# Altium schematic sheet 05004586宁波2号线二期车载PIS系统_功率放大器音频板2 BHC-A-2030-05_原理图 V1.0.SchDoc
size 594 x 419 mm; SheetNumber: 0; SheetTotal: 0; PageSetup: Record=PageOptions|CenterHorizontal=True|CenterVertical=True|PrintScale=0.68|XCorrection=1.00|YCorrection=1.00|PrintKind=0|BorderSize=5000000|LeftOffset=0|BottomOffset=0|Orientation=2|PaperLength=4200|PaperWidth=2970|Scale=100|PaperSource=7|PrintQuality=600|MediaType=1|DitherType=10|PaperKind=A3|PrintScaleMode=1
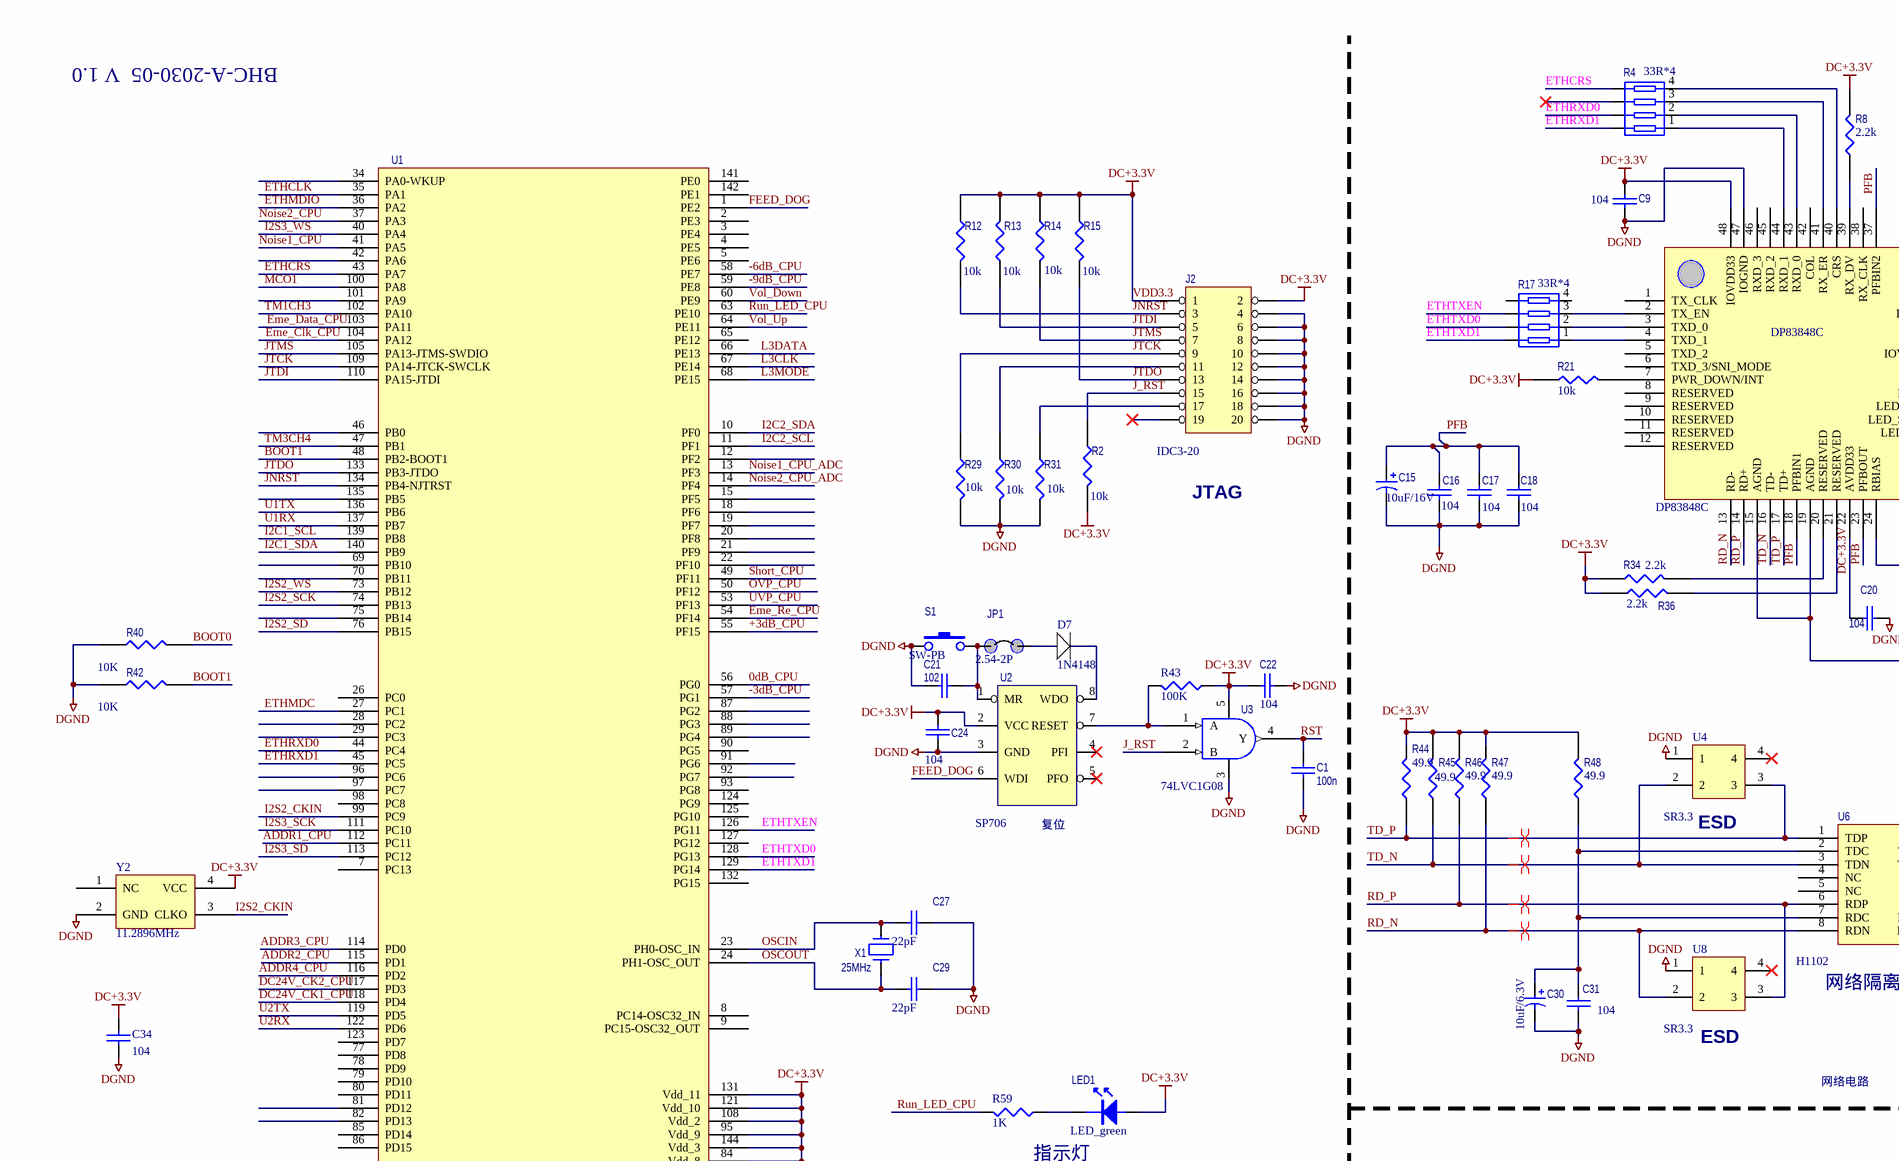
[diagram p0: 05004586宁波2号线二期车载PIS系统_功率放大器音频板2 BHC-A-2030-05_原理图 V1.0.SchDoc, top left]
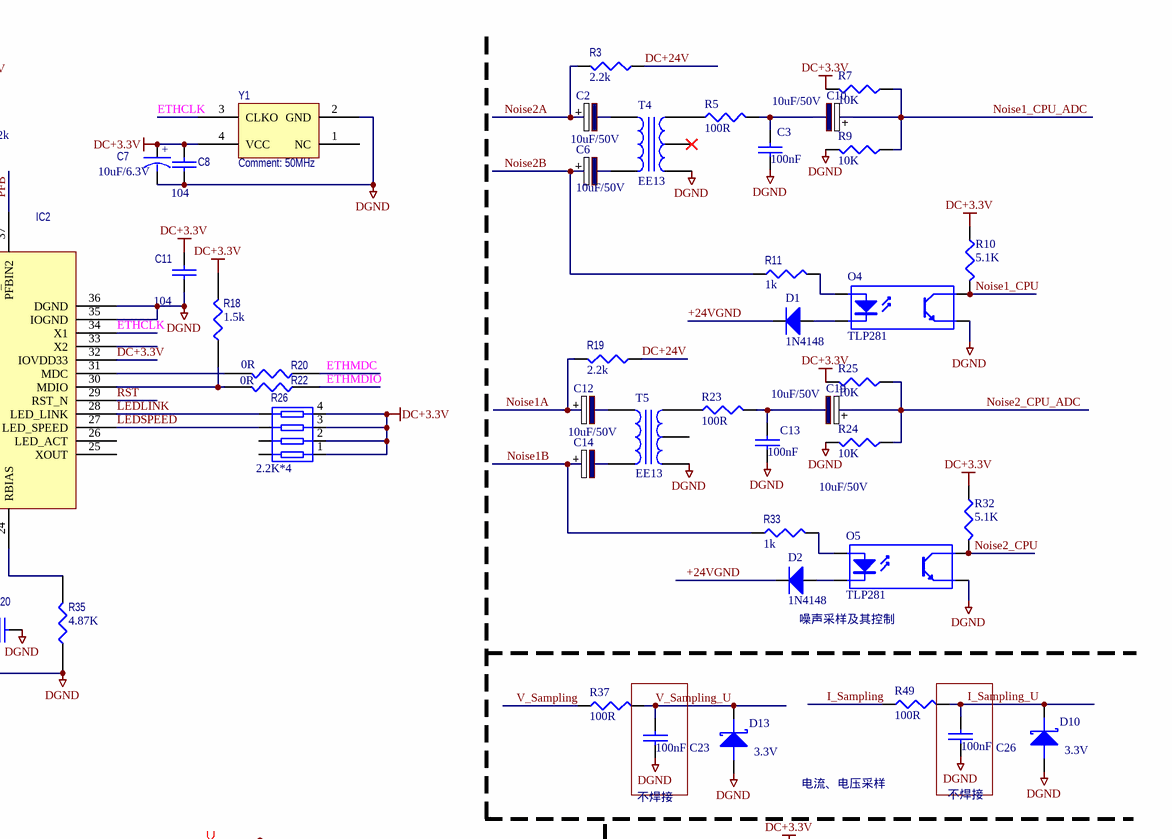
[diagram p1: 05004586宁波2号线二期车载PIS系统_功率放大器音频板2 BHC-A-2030-05_原理图 V1.0.SchDoc, top right]
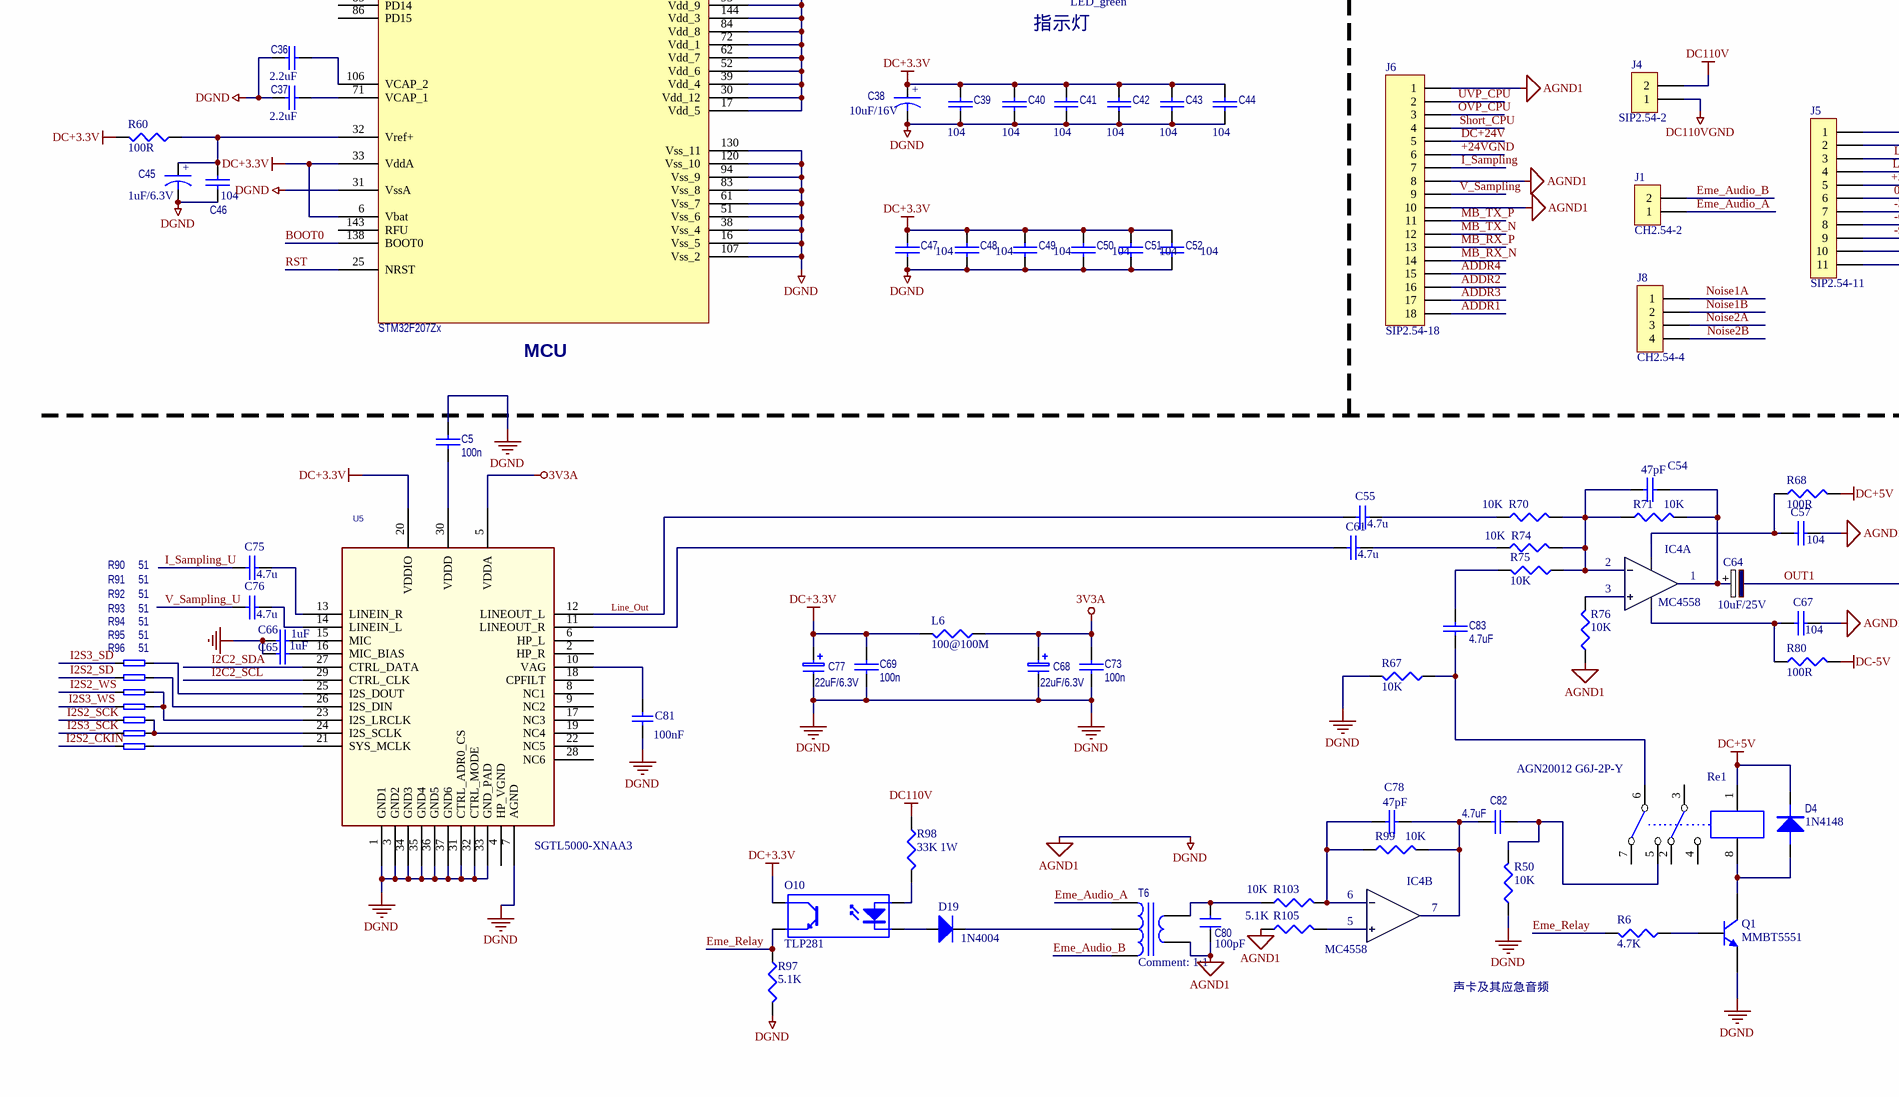
[diagram p2: 05004586宁波2号线二期车载PIS系统_功率放大器音频板2 BHC-A-2030-05_原理图 V1.0.SchDoc, bottom left]
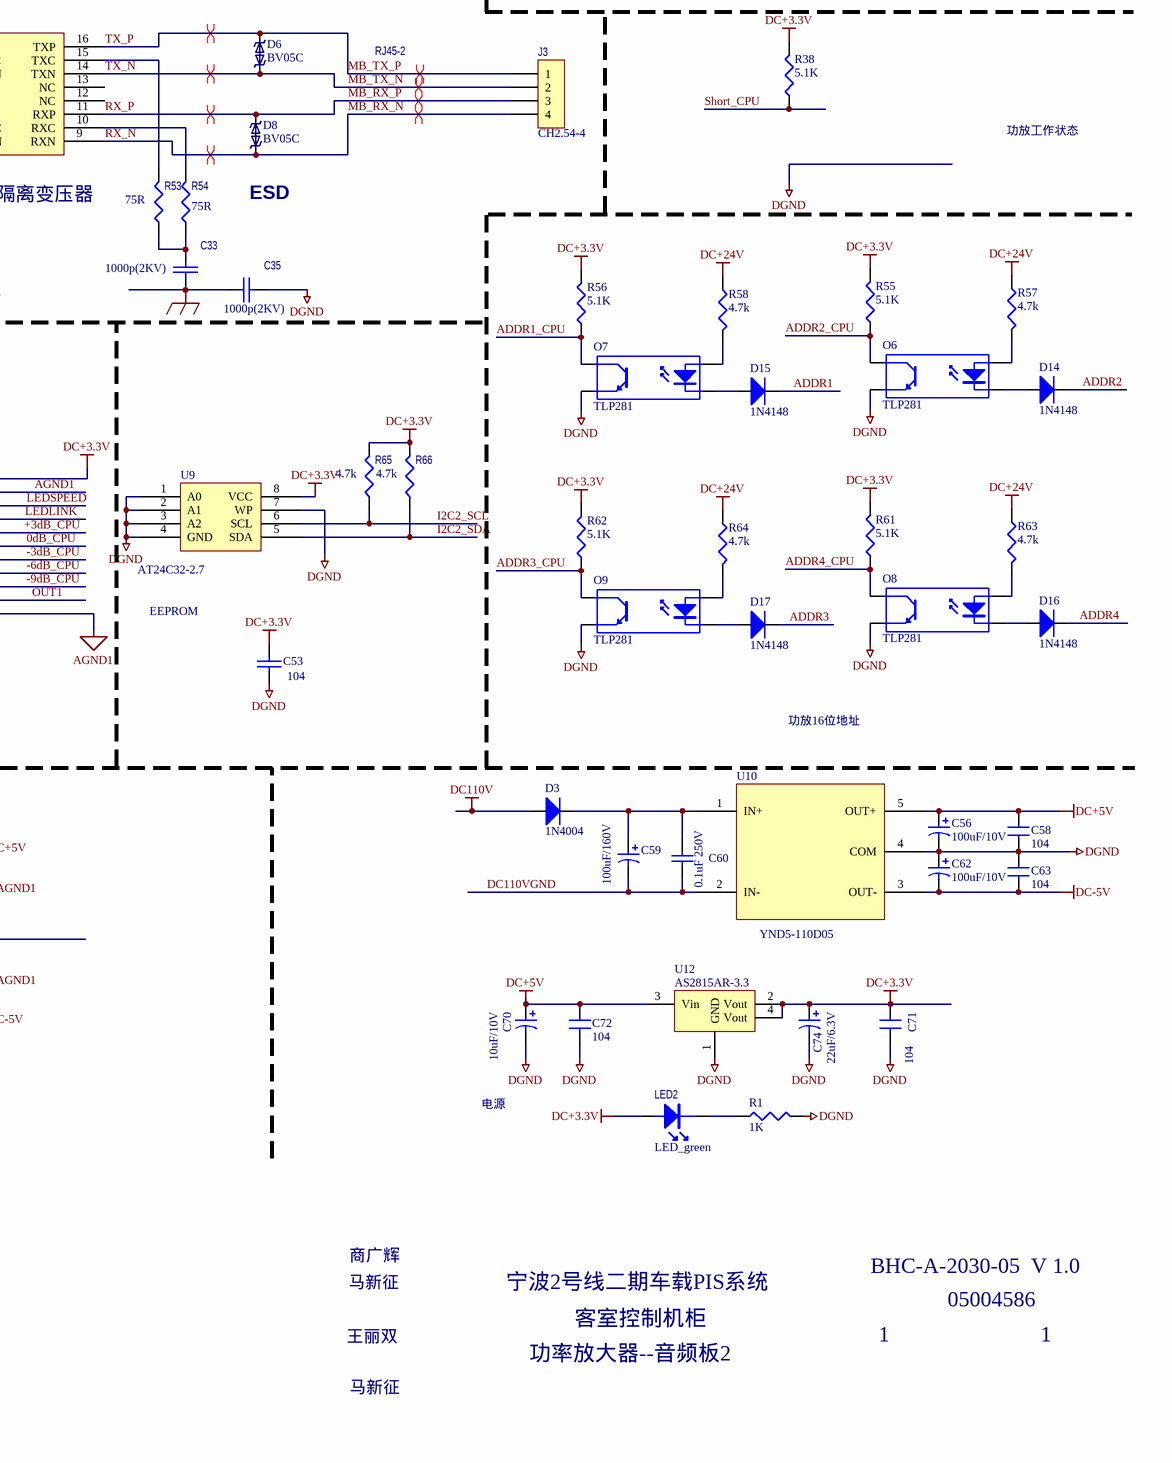
[diagram p3: 05004586宁波2号线二期车载PIS系统_功率放大器音频板2 BHC-A-2030-05_原理图 V1.0.SchDoc, bottom right]

## Parts
C1  100n  [C0805]
C2  value 10uF/50V  [RB1/2]  (hidden comment: 10uF/25V)
C3  value 100nF  [C0805]
C5  100n  [C0805]
C6  value 10uF/50V  [RB1/2]  (hidden comment: 10uF/25V)
C7  value 10uF/6.3V  [3216A]
C8  104  [C0805]
C9  104  [C0805]
C10  value 10uF/50V  [RB1/2]  (hidden comment: 10uF/25V)
C11  104  [C0805]
C12  value 10uF/50V  [RB1/2]  (hidden comment: 10uF/25V)
C13  value 100nF  [C0805]
C14  value 10uF/50V  [RB1/2]  (hidden comment: 10uF/25V)
C15  10uF/16V  [CAP-B]
C16  104  [C0805]
C17  104  [C0805]
C18  104  [C0805]
C19  value 10uF/50V  [RB1/2]  (hidden comment: 10uF/25V)
C20  104  [C0805]
C21  102  [C0805]
C22  104  [C0805]
C23  value 100nF  [C0805]
C24  104  [C0805]
C26  value 100nF  [C0805]
C27  value 22pF  [C0805]
C29  22pF  [C0805]
C30  value 10uF/6.3V  [3216A]  (hidden comment: 10uF/10V)
C31  104  [C0805]
C33  1000p(2KV)  [C1206]
C34  104  [C0805]
C35  1000p(2KV)  [C1206]
C36  2.2uF  [C0805]
C37  2.2uF  [C0805]
C38  value 10uF/16V  [CAP-B]
C39  104  [C0805]
C40  104  [C0805]
C41  104  [C0805]
C42  104  [C0805]
C43  104  [C0805]
C44  104  [C0805]
C45  value 1uF/6.3V  [3216A]
C46  104  [C0805]
C47  104  [C0805]
C48  104  [C0805]
C49  104  [C0805]
C50  104  [C0805]
C51  104  [C0805]
C52  104  [C0805]
C53  104  [C0805]
C54  47pF  [C0805]
C55  value 4.7u  [C0805]  (hidden comment: 104)
C56  value 100uF/10V  [CAP-D]  (hidden comment: 100uF/16V)
C57  104  [C0805]
C58  104  [C0805]
C59  value 100uF/160V  [E100]  (hidden comment: 100uF/16V)
C60  value 0.1uF 250V  [M1206]
C61  value 4.7u  [C0805]  (hidden comment: 104)
C62  value 100uF/10V  [CAP-D]  (hidden comment: 100uF/16V)
C63  104  [C0805]
C64  10uF/25V  [RB1/2]
C65  1uF  [C0805]
C66  1uF  [C0805]
C67  104  [C0805]
C68  22uF/6.3V  [3216A]
C69  100n  [C0805]
C70  10uF/10V  [3216A]
C71  104  [C0805]
C72  104  [C0805]
C73  100n  [C0805]
C74  22uF/6.3V  [3216A]
C75  value 4.7u  [C0805]  (hidden comment: 104)
C76  value 4.7u  [C0805]  (hidden comment: 104)
C77  22uF/6.3V  [3216A]
C78  47pF  [C0805]
C80  value 100pF  [C0805]  (hidden comment: 100p)
C81  value 100nF  [C0805]  (hidden comment: 100n)
C82  4.7uF  [C0805]
C83  4.7uF  [C0805]
D1  value 1N4148  [7227AK]  (hidden comment: DIODE)
D2  value 1N4148  [7227AK]  (hidden comment: DIODE)
D3  value 1N4004  [7227AK]  (hidden comment: DIODE)
D4  value 1N4148  [7227AK]  (hidden comment: 1N4004)
D6  BV05C  [SOD-323]
D7  value 1N4148  [1206AK]
D8  BV05C  [SOD-323]
D10  value 3.3V  [1206ak]
D13  value 3.3V  [1206ak]
D14  value 1N4148  [7227AK]  (hidden comment: DIODE)
D15  value 1N4148  [7227AK]  (hidden comment: DIODE)
D16  value 1N4148  [7227AK]  (hidden comment: DIODE)
D17  value 1N4148  [7227AK]  (hidden comment: DIODE)
D19  value 1N4004  [7227AK]  (hidden comment: DIODE)
IC2  DP83848C  [LQFP48]
IC4  MC4558  [SO-8]  (parts A,B of 2)
J1  value CH2.54-2  [CH2.54-2]  (hidden comment: CON2)
J2  value IDC3-20  [IDC3-20]  (hidden comment: IDC20)
J3  value CH2.54-4  [CH2.54-4]  (hidden comment: CON4)
J4  value SIP2.54-2  [SIP2.54-2]  (hidden comment: CON2)
J5  value SIP2.54-11  [SIP2.54-11]  (hidden comment: CON11)
J6  value SIP2.54-18  [SIP2.54-18]  (hidden comment: CON18)
J8  value CH2.54-4  [CH2.54-4]  (hidden comment: CON4)
JP1  2.54-2P  [SIP2.54-2]
L6  value 100@100M  [M0805]  (hidden comment: 10uH)
LED1  value LED_green  [LED(贴片)]
LED2  value LED_green  [LED(贴片)]
O4  TLP281  [SOP4]
O5  TLP281  [SOP4]
O6  TLP281  [SOP4]
O7  TLP281  [SOP4]
O8  TLP281  [SOP4]
O9  TLP281  [SOP4]
O10  TLP281  [SOP4]
Q1  MMBT5551  [SOT-23B_N]
R1  value 1K  [M0805]
R2  10K  [M0805]
R3  value 2.2k  [M0805]
R4  value 33R*4  [PZ-4-0.8B]  (hidden comment: 33*4)
R5  value 100R  [M0805]
R6  value 4.7K  [M0805]  (hidden comment: Res3)
R7  value 10K  [M0805]
R8  value 2.2k  [M0805]  (hidden comment: 10K)
R9  value 10K  [M0805]
R10  value 5.1K  [M0805]
R11  value 1k  [M0805]
R12  10K  [M0805]
R13  10K  [M0805]
R14  10K  [M0805]
R15  10K  [M0805]
R17  value 33R*4  [PZ-4-0.8B]  (hidden comment: 33*4)
R18  value 1.5k  [M0805]  (hidden comment: 10K)
R19  value 2.2k  [M0805]
R20  value 0R  [M0805]
R21  10K  [M0805]
R22  value 0R  [M0805]
R23  value 100R  [M0805]
R24  value 10K  [M0805]
R25  value 10K  [M0805]
R26  (no value)  [PZ-4-0.8B]
R29  10K  [M0805]
R30  10K  [M0805]
R31  10K  [M0805]
R32  value 5.1K  [M0805]
R33  value 1k  [M0805]
R34  value 2.2k  [M0805]  (hidden comment: 10K)
R35  value 4.87K  [M0805]
R36  value 2.2k  [M0805]  (hidden comment: 10K)
R37  value 100R  [M0805]
R38  value 5.1K  [M0805]
R40  10K  [M0805]
R42  10K  [M0805]
R43  value 100K  [M0805]
R44  value 49.9  [M0805]
R45  value 49.9  [M0805]
R46  value 49.9  [M0805]
R47  value 49.9  [M0805]
R48  value 49.9  [M0805]
R49  value 100R  [M0805]
R50  10k  [M0805]
R53  value 75R  [M0805]
R54  value 75R  [M0805]
R55  value 5.1K  [M0805]
R56  value 5.1K  [M0805]
R57  value 4.7k  [M1206]
R58  value 4.7k  [M1206]
R59  value 1K  [M0805]
R60  value 100R  [M0805]
R61  value 5.1K  [M0805]
R62  value 5.1K  [M0805]
R63  value 4.7k  [M1206]
R64  value 4.7k  [M1206]
R65  value 4.7k  [M0805]
R66  value 4.7k  [M0805]
R67  10k  [M0805]
R68  100R  [M0805]
R70  value 10K  [M0805]  (hidden comment: 15k)
R71  value 10K  [M0805]  (hidden comment: 11k)
R74  10k  [M0805]
R75  10k  [M0805]
R76  10k  [M0805]
R80  100R  [M0805]
R90  51  [M0805]
R91  51  [M0805]
R92  51  [M0805]
R93  51  [M0805]
R94  51  [M0805]
R95  51  [M0805]
R96  51  [M0805]
R97  value 5.1K  [M0805]
R98  value 33K 1W  [1T-2512]
R99  value 10K  [M0805]  (hidden comment: 11k)
R103  10k  [M0805]
R105  value 5.1K  [M0805]  (hidden comment: 10k)
Re1  AGN20012 G6J-2P-Y  [G6J-2P]
S1  SW-PB  [KEY-6A]
T4  EE13  [EE13-C]
T5  EE13  [EE13-C]
T6  1:1  [EE13-C]
U1  STM32F207Zx  [LQFP144]
U2  value SP706  [so-8]  (hidden comment: MAX706R)
U3  74LVC1G08  [SOT-23-5+]
U4  SR3.3  [SOT-143]
U5  value SGTL5000-XNAA3  [QFN32]  (hidden comment: SGTL5000-XNAA3_0)
U6  H1102  [SOP-16]
U8  SR3.3  [SOT-143]
U9  AT24C32-2.7  [SO-8]
U10  value YND5-110D05  [YND5-48D12]
U12  AS2815AR-3.3  [TO-252-1]
X1  25MHz  [XTAL-D]
Y1  50MHz  [XTAL-XO53]
Y2  11.2896MHz  [XTAL-XO53]

## Nets
3V3A: C68.1 C73.2 L6.1 U5.5(VDDA)
AGND1: C1.1 C3.1 C5.2 C7.2 C8.1 C9.2 C11.1 C13.1 C15.2 C16.1 C17.1 C18.1 C20.1 C21.2 C22.1 C23.1 C24.1 C26.1 C27.2 C29.2 C30.2 C31.1 C34.1 C35.2 C36.1 C37.1 C38.2 C39.1 C40.1 C41.1 C42.1 C43.1 C44.1 C45.2 C46.1 C47.1 C48.1 C49.1 C50.1 C51.1 C52.1 C53.1 C56.2 C57.1 C58.1 C62.1 C63.2 C65.2 C66.2 C67.1 C68.2 C69.1 C70.2 C71.2 C72.2 C73.1 C74.2 C77.2 C80.2 C81.1 D10.A D13.A IC2.15(AGND) IC2.19(AGND) IC2.35(IOGND) IC2.36(DGND) IC2.47(IOGND) J2.4 J2.6 J2.8 J2.10 J2.12 J2.14 J2.16 J2.18 J2.20 J5.2 J5.11 J6.1 J6.8 J6.10 O4.3(E) O5.3(E) O6.3(E) O7.3(E) O8.3(E) O9.3(E) Q1.2(E) R1.1 R9.2 R24.2 R29.1 R30.1 R31.1 R35.2 R40.2 R42.2 R50.1 R67.2 R76.1 R97.1 R105.1 S1.1 T4.5 T5.5 T6.1 U1.16(Vss_5) U1.31(VssA) U1.38(Vss_4) U1.51(Vss_6) U1.61(Vss_7) U1.83(Vss_8) U1.94(Vss_9) U1.107(Vss_2) U1.120(Vss_10) U1.130(Vss_11) U2.3(GND) U3.3(G) U4.1 U5.1(GND1) U5.3(GND2) U5.7(AGND) U5.31(CTRL_ADR0_CS) U5.32(CTRL_MODE) U5.33(GND_PAD) U5.34(GND3) U5.35(GND4) U5.36(GND5) U5.37(GND6) U8.1 U9.1(A0) U9.2(A1) U9.3(A2) U9.4(GND) U9.7(WP) U10.4(COM) U12.1(GND) Y1.2(GND) Y2.2(GND)  [also labelled DGND, G]
DC110V: D3.A J4.2 R98.2
DC110VGND: C59.2 C60.1 J4.1 U10.2(IN-)
DC+3.3V: C7.1 C8.2 C9.1 C11.2 C20.2 C22.2 C24.2 C34.2 C38.1 C39.2 C40.2 C41.2 C42.2 C43.2 C44.2 C47.2 C48.2 C49.2 C50.2 C51.2 C52.2 C53.2 C69.2 C71.1 C74.1 C77.1 IC2.22(AVDD33) IC2.32(IOVDD33) IC2.48(IOVDD33) J2.1 J2.2 J5.1 L6.2 LED1.1 LED2.1 O10.4(C) R2.1 R7.2 R8.1 R10.1 R12.2 R13.1 R14.2 R15.2 R18.1 R21.2 R25.2 R26.1 R26.2 R26.3 R26.4 R32.1 R34.2 R36.2 R38.1 R43.2 R44.1 R45.1 R46.1 R47.1 R48.1 R55.1 R56.1 R60.1 R61.1 R62.1 R65.1 R66.1 U1.6(Vbat) U1.17(Vdd_5) U1.30(Vdd_12) U1.33(VddA) U1.39(Vdd_4) U1.52(Vdd_6) U1.62(Vdd_7) U1.72(Vdd_1) U1.84(Vdd_8) U1.95(Vdd_9) U1.108(Vdd_2) U1.121(Vdd_10) U1.131(Vdd_11) U1.144(Vdd_3) U2.2(VCC) U3.5(V) U5.20(VDDIO) U9.8(VCC) U12.2(Vout) U12.4(Vout) Y1.4(VCC) Y2.4(VCC)  [also labelled V, VDD3.3]
DC+5V: C56.1 C58.2 C70.1 C72.1 D4.K R68.2 Re1.1 U10.5(OUT+) U12.3(Vin)
DC+24V: J6.5 R3.2 R19.2 R57.2 R58.2 R63.2 R64.2
DC-5V: C62.2 C63.1 R80.2 U10.3(OUT-)
EARTH: C33.1 C35.1
0dB_CPU: J5.6 U1.56(PG0)
+3dB_CPU: J5.5 U1.55(PF15)
+24VGND: D1.K D2.K J6.6
-3dB_CPU: J5.7 U1.57(PG1)
-6dB_CPU: J5.8 U1.58(PE7)
-9dB_CPU: J5.9 U1.59(PE8)
ADDR1: D15.K J6.18
ADDR1_CPU: O7.4(C) R56.2 U1.112(PC11)
ADDR2: D14.K J6.16
ADDR2_CPU: O6.4(C) R55.2 U1.115(PD1)
ADDR3: D17.K J6.17
ADDR3_CPU: O9.4(C) R62.2 U1.114(PD0)
ADDR4: D16.K J6.15
ADDR4_CPU: O8.4(C) R61.2 U1.116(PD2)
BOOT0: R40.1 U1.138(BOOT0)
BOOT1: R42.1 U1.48(PB2-BOOT1)
DC24V_CK1_CPU: U1.118(PD4)
DC24V_CK2_CPU: U1.117(PD3)
Eme_Audio_A: J1.1 T6.5
Eme_Audio_B: J1.2 T6.3
Eme_Clk_CPU: U1.104(PA12)
Eme_Data_CPU: U1.103(PA11)
Eme_Re_CPU: U1.54(PF14)
Eme_Relay: O10.3(E) R6.1 R97.2
ETHCLK: IC2.34(X1) U1.35(PA1) Y1.3(CLKO)
ETHCRS: R4.5 U1.43(PA7)
ETHMDC: R20.2 U1.27(PC1)
ETHMDIO: R22.2 U1.36(PA2)
ETHRXD0: R4.7 U1.44(PC4)
ETHRXD1: R4.8 U1.45(PC5)
ETHTXD0: R17.7 U1.128(PG13)
ETHTXD1: R17.8 U1.129(PG14)
ETHTXEN: R17.6 U1.126(PG11)
FEED_DOG: U1.1(PE2) U2.6(WDI)
I2C1_SCL: U1.139(PB8)
I2C1_SDA: U1.140(PB9)
I2C2_SCL: R65.2 U1.11(PF1) U5.29(CTRL_CLK) U9.6(SCL)
I2C2_SDA: R66.2 U1.10(PF0) U5.27(CTRL_DATA) U9.5(SDA)
I2S2_CKIN: R96.1 U1.99(PC9) Y2.3(CLKO)
I2S2_SCK: R94.1 U1.74(PB13)
I2S2_SD: R91.1 U1.76(PB15)
I2S2_WS: R92.1 U1.73(PB12)
I2S3_SCK: R95.1 U1.111(PC10)
I2S3_SD: R90.1 U1.113(PC12)
I2S3_WS: R93.1 U1.40(PA4)
I_Sampling: J6.7 R49.1
I_Sampling_U: C26.2 C75.2 D10.K R49.2
J_RST: J2.15 R2.2 U3.2(B)
JNRST: J2.3 R12.1 U1.134(PB4-NJTRST)
JTCK: J2.9 R29.2 U1.109(PA14-JTCK-SWCLK)
JTDI: J2.5 R13.2 U1.110(PA15-JTDI)
JTDO: J2.13 R15.1 U1.133(PB3-JTDO)
JTMS: J2.7 R14.1 U1.105(PA13-JTMS-SWDIO)
L3CLK: U1.67(PE14)
L3DATA: U1.66(PE13)
L3MODE: U1.68(PE15)
LEDLINK: IC2.28(LED_LINK) J5.4 R26.5
LEDSPEED: IC2.27(LED_SPEED) J5.3 R26.6
Line_Out: C55.2 U5.12(LINEOUT_L)
MB_RX_N: D8.A J3.4 J6.14 U6.9(RXN)  [also labelled RX_N]
MB_RX_P: D8.K J3.3 J6.13 U6.11(RXP)  [also labelled RX_P]
MB_TX_N: D6.A J3.2 J6.12 U6.14(TXN)  [also labelled TX_N]
MB_TX_P: D6.K J3.1 J6.11 U6.16(TXP)  [also labelled TX_P]
MCO1: U1.100(PA8)
Noise1_CPU: O4.4(C) R10.2 U1.41(PA5)
Noise1_CPU_ADC: C10.1 R7.1 R9.1 U1.13(PF3)
Noise1A: C12.1 J8.1 R19.1
Noise1B: C14.1 J8.2 R33.2
Noise2_CPU: O5.4(C) R32.2 U1.37(PA3)
Noise2_CPU_ADC: C19.1 R24.1 R25.1 U1.14(PF4)
Noise2A: C2.1 J8.3 R3.1
Noise2B: C6.1 J8.4 R11.2
OSCIN: C27.1 U1.23(PH0-OSC_IN) X1.2
OSCOUT: C29.1 U1.24(PH1-OSC_OUT) X1.1
OUT1: C64.2 J5.10
OVP_CPU: J6.3 U1.50(PF12)
PFB: C15.1 C16.2 C17.2 C18.2 IC2.18(PFBIN1) IC2.23(PFBOUT) IC2.37(PFBIN2)
RD_N: IC2.13(RD-) R47.2 U6.8(RDN) U8.2
RD_P: IC2.14(RD+) R46.2 U6.6(RDP) U8.3
RST: C1.2 IC2.29(RST_N) U1.25(NRST) U3.4(Y)
Run_LED_CPU: R59.1 U1.63(PE10)
Short_CPU: J6.4 R38.2 U1.49(PF11)
TD_N: IC2.16(TD-) R45.2 U4.2 U6.3(TDN)
TD_P: IC2.17(TD+) R44.2 U4.3 U6.1(TDP)
TM1CH3: U1.102(PA10)
TM3CH4: U1.47(PB1)
U1RX: U1.137(PB7)
U1TX: U1.136(PB6)
U2RX: U1.122(PD6)
U2TX: U1.119(PD5)
UVP_CPU: J6.2 U1.53(PF13)
V_Sampling: J6.9 R37.1
V_Sampling_U: C23.2 C76.2 D13.K R37.2
Vol_Down: U1.60(PE9)
Vol_Up: U1.64(PE11)
NetC2_2: C2.2 T4.2
NetC3_2: C3.2 C10.2 R5.2
NetC5_1: C5.1 U5.30(VDDD)
NetC6_2: C6.2 T4.1
NetC12_2: C12.2 T5.2
NetC13_2: C13.2 C19.2 R23.2
NetC14_2: C14.2 T5.1
NetC21_1: C21.1 JP1.1 S1.2 U2.1(MR)
NetC30_1: C30.1 C31.2 R48.2 U6.2(TDC) U6.7(RDC)
NetC33_2: C33.2 R53.2 R54.2
NetC36_2: C36.2 U1.106(VCAP_2)
NetC37_2: C37.2 U1.71(VCAP_1)
NetC45_1: C45.1 C46.2 R60.2 U1.32(Vref+)
NetC54_1: C54.1 IC4.2 R70.2 R71.1 R74.2 R75.1
NetC54_2: C54.2 C64.1 IC4.1 R71.2
NetC55_1: C55.1 R70.1
NetC57_2: C57.2 IC4.8 R68.1
NetC59_1: C59.1 C60.2 D3.K U10.1(IN+)
NetC61_1: C61.1 R74.1
NetC61_2: C61.2 U5.11(LINEOUT_R)
NetC65_1: C65.1 U5.15(MIC)
NetC66_1: C66.1 U5.16(MIC_BIAS)
NetC67_2: C67.2 IC4.4 R80.1
NetC75_1: C75.1 U5.13(LINEIN_R)
NetC76_1: C76.1 U5.14(LINEIN_L)
NetC78_1: C78.1 IC4.6 R99.1 R103.2
NetC78_2: C78.2 C82.2 IC4.7 R99.2
NetC80_1: C80.1 R103.1 T6.2
NetC81_2: C81.2 U5.10(VAG)
NetC82_1: C82.1 R50.2 Re1.5
NetC83_1: C83.1 R75.2
NetC83_2: C83.2 R67.1 Re1.6
NetD1_A: D1.A O4.2(K)
NetD2_A: D2.A O5.2(K)
NetD4_A: D4.A Q1.3(C) Re1.8
NetD7_A: D7.A JP1.2
NetD7_K: D7.K U2.8(WDO)
NetD14_A: D14.A O6.2(K)
NetD15_A: D15.A O7.2(K)
NetD16_A: D16.A O8.2(K)
NetD17_A: D17.A O9.2(K)
NetD19_A: D19.A O10.2(K)
NetD19_K: D19.K T6.4
NetIC2_2: IC2.2(TX_EN) R17.3
NetIC2_3: IC2.3(TXD_0) R17.2
NetIC2_4: IC2.4(TXD_1) R17.1
NetIC2_7: IC2.7(PWR_DOWN/INT) R21.1
NetIC2_20: IC2.20(RESERVED) R34.1
NetIC2_21: IC2.21(RESERVED) R36.1
NetIC2_24: IC2.24(RBIAS) R35.1
NetIC2_30: IC2.30(MDIO) R18.2 R22.1
NetIC2_31: IC2.31(MDC) R20.1
NetIC2_39: IC2.39(RX_DV) R8.2
NetIC2_40: IC2.40(CRS) R4.4
NetIC2_41: IC2.41(RX_ER) R4.3
NetIC2_43: IC2.43(RXD_0) R4.2
NetIC2_44: IC2.44(RXD_1) R4.1
NetIC4_3: IC4.3 R76.2
NetIC4_5: IC4.5 R105.2
NetJ2_11: J2.11 R30.2
NetJ2_17: J2.17 R31.2
NetLED1_2: LED1.2 R59.2
NetLED2_2: LED2.2 R1.2
NetO4_1: O4.1(A) R11.1
NetO5_1: O5.1(A) R33.1
NetO6_1: O6.1(A) R57.1
NetO7_1: O7.1(A) R58.1
NetO8_1: O8.1(A) R63.1
NetO9_1: O9.1(A) R64.1
NetO10_1: O10.1(A) R98.1
NetQ1_1: Q1.1(B) R6.2
NetR5_1: R5.1 T4.3
NetR23_1: R23.1 T5.3
NetR43_1: R43.1 U2.7(RESET) U3.1(A)
NetR53_1: R53.1 U6.15(TXC)
NetR54_1: R54.1 U6.10(RXC)
NetR90_2: R90.2 U5.25(I2S_DOUT)
NetR91_2: R91.2 U5.26(I2S_DIN)
NetR92_2: R92.2 R93.2 U5.23(I2S_LRCLK)
NetR94_2: R94.2 R95.2 U5.24(I2S_SCLK)
NetR96_2: R96.2 U5.21(SYS_MCLK)

Not connected (* = marked no-connect by the designer): IC2 1(TX_CLK) 5(TXD_2) 6(TXD_3/SNI_MODE) 8(RESERVED) 9(RESERVED) 10(RESERVED) 11(RESERVED) 12(RESERVED) 25(XOUT) 26(LED_ACT) 33(X2) 38(RX_CLK) 42(COL) 45(RXD_2) 46(RXD_3); J2 19*; R4 6*; R17 4 5; R26 7 8; Re1 2 3 4 7; T4 4*; T5 4; U1 2(PE3) 3(PE4) 4(PE5) 5(PE6) 7(PC13) 8(PC14-OSC32_IN) 9(PC15-OSC32_OUT) 12(PF2) 15(PF5) 18(PF6) 19(PF7) 20(PF8) 21(PF9) 22(PF10) 26(PC0) 28(PC2) 29(PC3) 34(PA0-WKUP) 42(PA6) 46(PB0) 65(PE12) 69(PB10) 70(PB11) 75(PB14) 77(PD8) 78(PD9) 79(PD10) 80(PD11) 81(PD12) 82(PD13) 85(PD14) 86(PD15) 87(PG2) 88(PG3) 89(PG4) 90(PG5) 91(PG6) 92(PG7) 93(PG8) 96(PC6) 97(PC7) 98(PC8) 101(PA9) 123(PD7) 124(PG9) 125(PG10) 127(PG12) 132(PG15) 135(PB5) 141(PE0) 142(PE1) 143(RFU); U2 4(PFI)* 5(PFO)*; U4 4*; U5 2(HP_R) 4(HP_VGND) 6(HP_L) 8(NC1) 9(NC2) 17(NC3) 18(CPFILT) 19(NC4) 22(NC5) 28(NC6); U6 4(NC) 5(NC) 12(NC) 13(NC); U8 4*; Y1 1(NC); Y2 1(NC)

## Layout directives
differential pair: MB_RX_N, MB_RX_P, MB_TX_N, MB_TX_P, RD_N, RD_P, TD_N, TD_P

## Notes on the sheet
- BHC-A-2030-05  V 1.0
- JTAG
- 噪声采样及其控制
- (near U2) 复位
- (near U4) ESD
- (near C23) 不焊接
- 电流、电压采样
- (near C26) 不焊接
- 功放工作状态
- (near U6) 网络隔离变压器
- (near D8) ESD
- (near U8) ESD
- 网络电路
- 指示灯
- EEPROM
- MCU
- 功放16位地址
- 电源
- 马新征
- 商广辉
- 宁波2号线二期车载PIS系统
- 05004586
- 声卡及其应急音频
- 王丽双
- 功率放大器--音频板2
- 客室控制机柜
- 1
- Labels drawn without touching a wire or pin: RJ45-2
- 媒体编号
- 旧底图总号
- 更改
- 标记
- 数量
- 更改单号
- 签 名
- 日期
- 底图总号
- 拟  制
- 审  核
- 标准化
- 第      张
- 天津市北海通信技术有限公司
- 共      张
- 格式
- (3)
- 制图
- 批  准
- ：
- 描图
- 图幅
- (in symbol CAPACITOR POL) +
- (in symbol RES-P4) 2.2K*4

## Library data of the parts
C1 C3 C5 C8 C9 C11 C13 C16-C18 C20-C24 C26 C27 C29 C33 C35-C37 C46 C53-C55 C57 C58 C61 C63 C67 C69 C71-C73 C75 C76 C78 C80 C82 C83 = CAP: Capacitor
  C8 C9 C11 C16-C18 C22 C24 C46 C53 C57 C58 C63 C67 C71 C72: Value: 104
  C29: Value: 22pF
  C36 C37: Value: 2.2uF
  C54 C78: Value: 47pF
C2 C6 C10 C12 C14 C19 C64 = E
  C64: Value: 10uF/25V
C7 C38 C45 = CAPACITOR POL: Capacitor
C15 C30 C56 C59 C62 C70 C74 = CAP2: Bi-Polar Capacitor
  C15: Value: 10uF/16V
  C70: Value: 10uF/10V
  C74: Value: 22uF/6.3V
C31 C34 C39-C44 C47-C52 = CAP: Value: 104
C60 C65 C66 C81 = Cap: Capacitor; Published: 8-Jun-2000; LatestRevisionDate: 17-Jul-2002; LatestRevisionNote: Re-released for DXP Platform.; PackageReference: RAD-0.3; Publisher: Altium Limited; PackageDescription: Radial Cap, Thru-Hole; 2 Leads; 0.3 in Pin Spacing
  C65 C66: Value: 1uF
C68 C77 = CAPBP2: Bi-Polar Capacitor; Part Field 10: 10K; Text Field1: Published 8-Jun-2000; Value: 22uF/6.3V; Part Field 2: 10K; Part Field 3: 10K; Part Field 4: 10K; Part Field 5: 10K; Part Field 6: 10K; Part Field 7: 10K; Part Field 8: 10K; Part Field 9: 10K; Part Field 11: 10K; Part Field 12: 10K; Part Field 13: 10K; Part Field 14: 10K; Part Field 15: 10K; Part Field 16: 10K
D1-D3 D14-D17 D19 = DIODE: Default Diode; Text Field6: Published 8-Jun-2000
D4 = DIODE
D7 = D
D10 D13 = DIODE SCHOTTKY: Schottky Diode
J1 J4 = CON2: Connector
J2 = HEADER 10X2
J3 = CON4: Connector
J6 = CON18: Connector
JP1 = TX: Value: 2.54-2P
L6 R1 R5-R7 R9 R10 R23-R25 R32 R37 R38 R43 R49 R50 R55-R64 R67 R68 R70 R71 R74-R76 R80 R97-R99 R103 R105 = Res3: Resistor; Published: 8-Jun-2000; LatestRevisionDate: 29-May-2009; LatestRevisionNote: IPC-7351 Footprint Added.; Publisher: Altium Limited; PackageDescription: Chip Resistor
  L6 R70 R71 R99 R105: PackageReference: M0805
  R1 R5-R7 R9 R10 R23-R25 R32 R37 R38 R43 R49 R55-R64 R97 R98: PackageReference: J1-0603
  R50 R67 R74-R76 R103: PackageReference: M0805; Value: 10K
  R68 R80: PackageReference: M0805; Value: 100R
LED1 LED2 = LED
O4-O10 = Optoisolator1: 4-Pin Phototransistor Optocoupler; Published: 24-Mar-1999; LatestRevisionDate: 04-Mar-2005; LatestRevisionNote: Sch pins 3 & 4 Swapped.; DatasheetVersion: Nov-2003; PackageReference: DIP-4; Publisher: Altium Limited; Value: TLP281
Q1 = NPN: NPN Bipolar Transistor; Published: 8-Jun-2000; LatestRevisionDate: 17-Jul-2002; LatestRevisionNote: Re-released for DXP Platform.; PackageReference: TO-226-AA; Publisher: Altium Limited; PackageDescription: TO, Flat Index; 3 In-Line, Axial Leads; Body Dia. 4.8mm; Leads 0.55 x 0.51 mm (max); Code_JEDEC: TO-226-AA; Value: MMBT5551
R2 R3 R8 R11-R15 R18-R22 R29-R31 R33-R36 R40 R42 R44-R48 R53 R54 R65 R66 = RES1
  R2 R12-R15 R21 R29-R31: Value: 10k
  R40 R42: Value: 10K
R4 R17 R26 = RES-P4
R90-R96 = R: Part Field 1: 10K; Part Field 2: 10K; Part Field 3: 10K; Part Field 4: 10K; Part Field 5: 10K; Part Field 6: 10K; Part Field 7: 10K; Part Field 8: 10K; Part Field 9: 10K; Part Field 10: 10K; Part Field 11: 10K; Part Field 12: 10K; Part Field 13: 10K; Part Field 14: 10K; Part Field 15: 10K; Part Field 16: 10K
Re1 = G6J-2P
T6 = TRANS7
U9 = AT24C32: Value: AT24C32-2.7
U10 = YND5-48D12
U12 = LT1085
X1 = CRYSTAL
Y1 Y2 = XTAL
  Y2: Value: 11.2896MHz
IC2 = DP83848C: Value: DP83848C
IC4 = MC4558: Value: MC4558
S1 = SW-PB: Value: SW-PB
T4 T5 = EE13: Value: EE13
U3 = 74LVC1G08: Value: 74LVC1G08
U4 U8 = SR3.3: Value: SR3.3
U6 = H1102: Value: H1102